# Altium schematic sheet PWM_Expander.SchDoc
size C; SheetNumber: 5; SheetTotal: 5
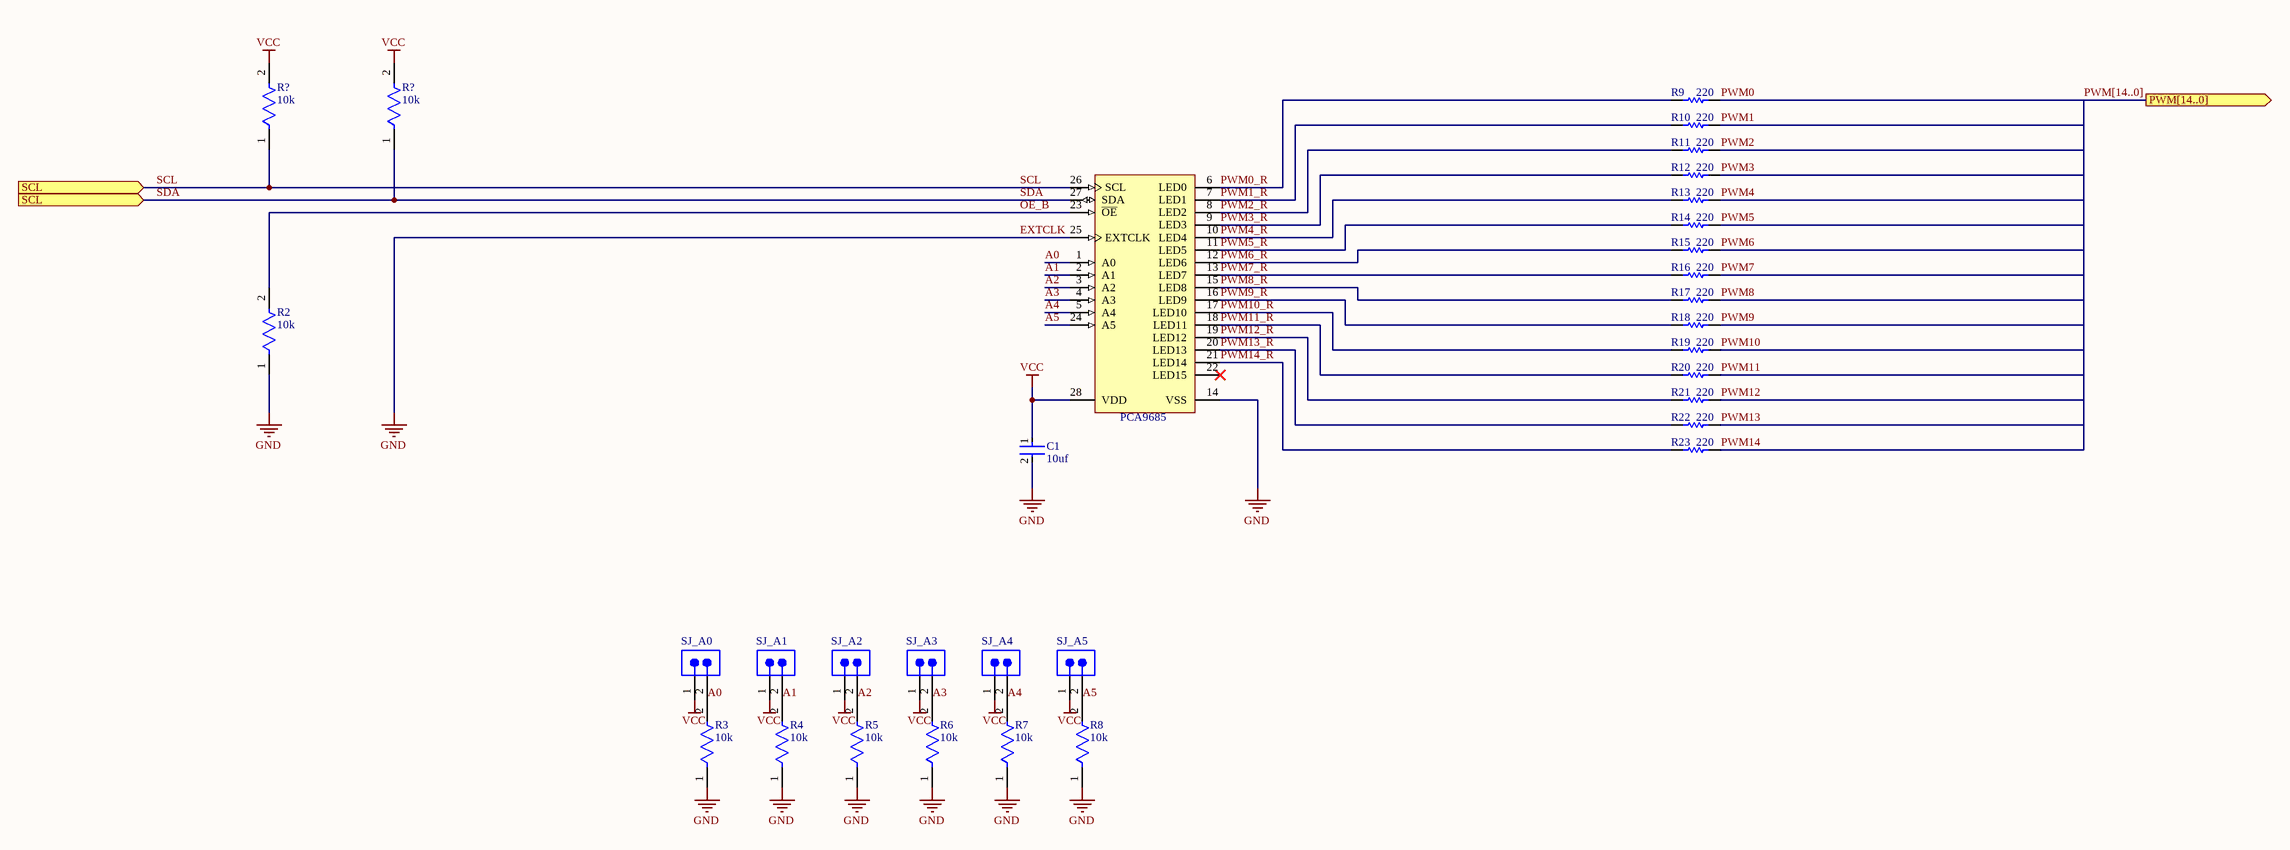
[diagram p0: PWM_Expander.SchDoc]

## Parts
(Parts that share a designator on the sheet are numbered #1, #2 ... from top to bottom, then left to right.)
?  PCA9685  [SOT361-1_V]
C1  10uf  [FP-GRM21B-0_1-MFG]
R2  10k  [FP-RC0402-0_4-IPC_C]
R3  10k  [FP-RC0402-0_4-IPC_C]
R4  10k  [FP-RC0402-0_4-IPC_C]
R5  10k  [FP-RC0402-0_4-IPC_C]
R6  10k  [FP-RC0402-0_4-IPC_C]
R7  10k  [FP-RC0402-0_4-IPC_C]
R8  10k  [FP-RC0402-0_4-IPC_C]
R9  220  [RESC1005X40X25ML05T10]
R10  220  [RESC1005X40X25ML05T10]
R11  220  [RESC1005X40X25ML05T10]
R12  220  [RESC1005X40X25ML05T10]
R13  220  [RESC1005X40X25ML05T10]
R14  220  [RESC1005X40X25ML05T10]
R15  220  [RESC1005X40X25ML05T10]
R16  220  [RESC1005X40X25ML05T10]
R17  220  [RESC1005X40X25ML05T10]
R18  220  [RESC1005X40X25ML05T10]
R19  220  [RESC1005X40X25ML05T10]
R20  220  [RESC1005X40X25ML05T10]
R21  220  [RESC1005X40X25ML05T10]
R22  220  [RESC1005X40X25ML05T10]
R23  220  [RESC1005X40X25ML05T10]
R?#1  10k  [FP-RC0402-0_4-IPC_C]
R?#2  10k  [FP-RC0402-0_4-IPC_C]
SJ_A0  61300211021  [61300211021]  (value not drawn)
SJ_A1  61300211021  [61300211021]  (value not drawn)
SJ_A2  61300211021  [61300211021]  (value not drawn)
SJ_A3  61300211021  [61300211021]  (value not drawn)
SJ_A4  61300211021  [61300211021]  (value not drawn)
SJ_A5  61300211021  [61300211021]  (value not drawn)

## Ports
PWM[14..0] (out), SCL (in)

## Nets
EXTCLK: ?.14(VSS) ?.25(EXTCLK) C1.2 R2.1 R3.1 R4.1 R5.1 R6.1 R7.1 R8.1  [also labelled GND]
VCC: ?.28(VDD) C1.1 R?#1.2 R?#2.2 SJ_A0.1 SJ_A1.1 SJ_A2.1 SJ_A3.1 SJ_A4.1 SJ_A5.1
A0: ?.1(A0) R3.2 SJ_A0.2
A1: ?.2(A1) R4.2 SJ_A1.2
A2: ?.3(A2) R5.2 SJ_A2.2
A3: ?.4(A3) R6.2 SJ_A3.2
A4: ?.5(A4) R7.2 SJ_A4.2
A5: ?.24(A5) R8.2 SJ_A5.2
OE_B: ?.23(~{OE}) R2.2
PWM0: R9.2  [also labelled PWM[14..0]]
PWM0_R: ?.6(LED0) R9.1
PWM1: R10.2
PWM1_R: ?.7(LED1) R10.1
PWM2: R11.2
PWM2_R: ?.8(LED2) R11.1
PWM3: R12.2
PWM3_R: ?.9(LED3) R12.1
PWM4: R13.2
PWM4_R: ?.10(LED4) R13.1
PWM5: R14.2
PWM5_R: ?.11(LED5) R14.1
PWM6: R15.2
PWM6_R: ?.12(LED6) R15.1
PWM7: R16.2
PWM7_R: ?.13(LED7) R16.1
PWM8: R17.2
PWM8_R: ?.15(LED8) R17.1
PWM9: R18.2
PWM9_R: ?.16(LED9) R18.1
PWM10: R19.2
PWM10_R: ?.17(LED10) R19.1
PWM11: R20.2
PWM11_R: ?.18(LED11) R20.1
PWM12: R21.2
PWM12_R: ?.19(LED12) R21.1
PWM13: R22.2
PWM13_R: ?.20(LED13) R22.1
PWM14: R23.2
PWM14_R: ?.21(LED14) R23.1
SCL: ?.26(SCL) ?.27(SDA) R?#1.1 R?#2.1 ; port SCL  [also labelled SDA]

Not connected (* = marked no-connect by the designer): ? 22(LED15)*

## Library data of the parts
? = CMP-1595-00004-2: 16-Channel, 12-Bit PWM Fm+ I2C-Bus LED Controller, 2.3 to 5.5 V, -40 to 85 degC, 28-Pin TSSOP (SOT361-1), RoHS, Tape and Reel; Supply Current Max: 10 mA; Supply Voltage Min: 2.3 V; Supply Voltage Max: 5.5 V; Frequency: 25000000 Hz; Temperature Min: -40 degC; PackageDescription: 28-Pin Small Outline Package, Body 9.7 x 4.4 mm, Pitch 0.65 mm; RoHS: TRUE; ComponentLink1Description: Manufacturer URL; Code_JEDEC: MO-153; PartNumber: PCA9685; ComponentLink2URL: http://www.nxp.com/documents/data_sheet/PCA9685.pdf; Packing: Tape and Reel; ComponentLink1URL: http://www.nxp.com/; ComponentLink3Description: Package Specification; ComponentLink2Description: Datasheet; ComponentLink3URL: http://www.nxp.com/documents/outline_drawing/sot361-1_po.pdf; DatasheetVersion: Rev. 4; Temperature Max: 85 degC; PackageVersion: 02/2003; Mounting Technology: Surface Mount
C1 = CMP-2007-03534-2: Chip Multilayer Ceramic Capacitors for General Purpose, 0805, 10uF, X5R, 15%, 10%, 16V; Case Code (Imperial): 0805; Packaging: Tape and Reel; Width: 0.049inch; Depth: 1.25mm; Voltage Rating: 16V; Height: 1.25mm; Case/Package: 0805; Max Operating Temperature: 85°C; Min Operating Temperature: -55°C; Tolerance: 10%; Dielectric: X5R; REACH SVHC: No SVHC; Mount: Surface Mount; Radiation Hardening: No; Case Code (Metric): 2012; Length: 2mm; Package Quantity: 10000; Voltage Rating (DC): 16V; Voltage: 16V; Capacitance: 10uF; Thickness: 0.053inch; Termination: SMD/SMT
R2-R8 R?#1 R?#2 = CMP-2002-07915-3: RES 10K OHM 5% 1/16W 0402; Max Power Dissipation: 63mW; Temperature Coefficient: 100ppm/°C; Power Rating: 62.5mW; Resistance: 10kR; Voltage Rating: 50V; Size Code: 0402; Resistance Tolerance: 5%; Packaging: Tape and Reel; Case Code (Metric): 1005; Lead Free: Lead Free; Resistor Type: Thick Film; Min Operating Temperature: -55°C; Military Standard: Not; Depth: 0.5mm; Series: RC; Case/Package: 0402; Construction: Rectangular; Number of Terminations: 2; Package Quantity: 1; Termination: SMD/SMT; Length: 0.039inch; Case Code (Imperial): 0402; Height: 0.016inch; Features: Moisture Resistant; RoHS Compliant: Yes; Max Operating Temperature: 155°C; Tolerance: 5%; Width: 0.02inch
R9-R23 = CMP-2002-08074-1: Manufacturer: Yageo; Part Number: RC0402JR-13220RL
SJ_A0-SJ_A5 = CMP-1502-01059-3: NexarPartId: 32855519; Gender: Male; Contact Resistance: 20mΩ; Operating Supply Voltage: 250V; Connector Type: Male Pin; Current Rating: 3A; Number of Contacts: 2; Pitch: 2.54mm; Termination: Solder; Number of Pins: 2; Number of Rows: 1; Contact Plating: Gold; Contact Material: Copper; REACH SVHC: Unknown; Mount: Through Hole; RoHS: Compliant; Color: Black; Packaging: Bulk; Contact Mating Length: 5.9944mm; Number of Positions: 2; Lead Pitch: 2.54mm